# EAGLE board NeuroStimDuino_v2 (EAGLE 9.6.2), part 1 of 2
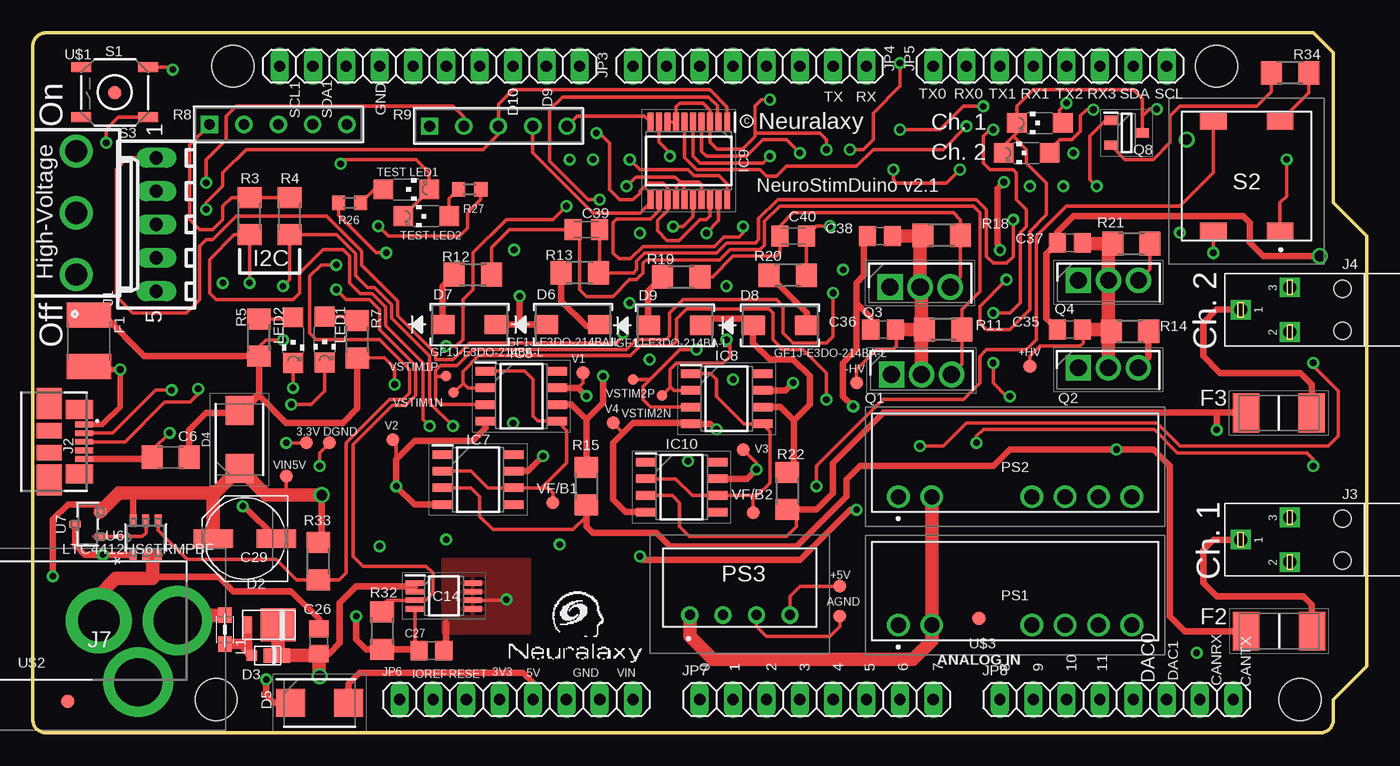
[diagram p6: board, top side]
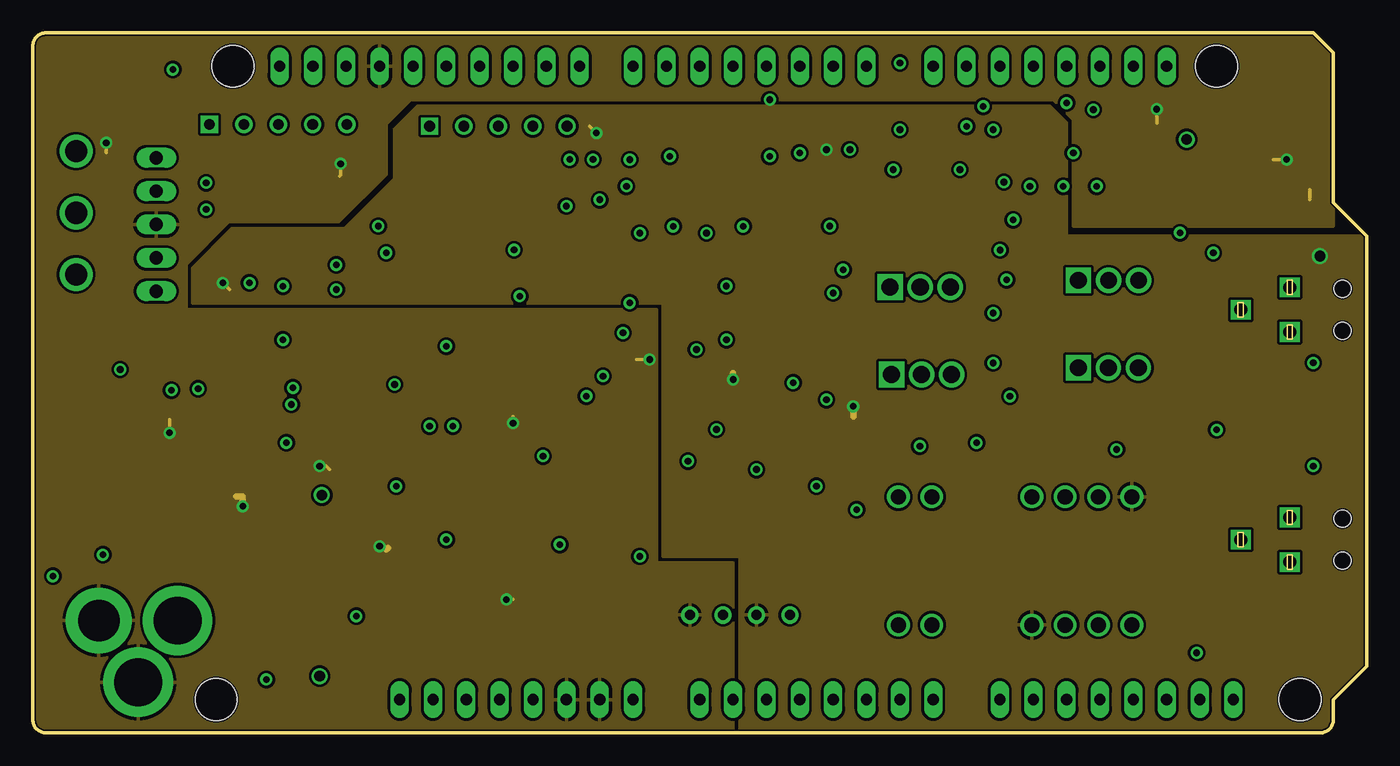
[diagram p7: board, inner layer Route2]
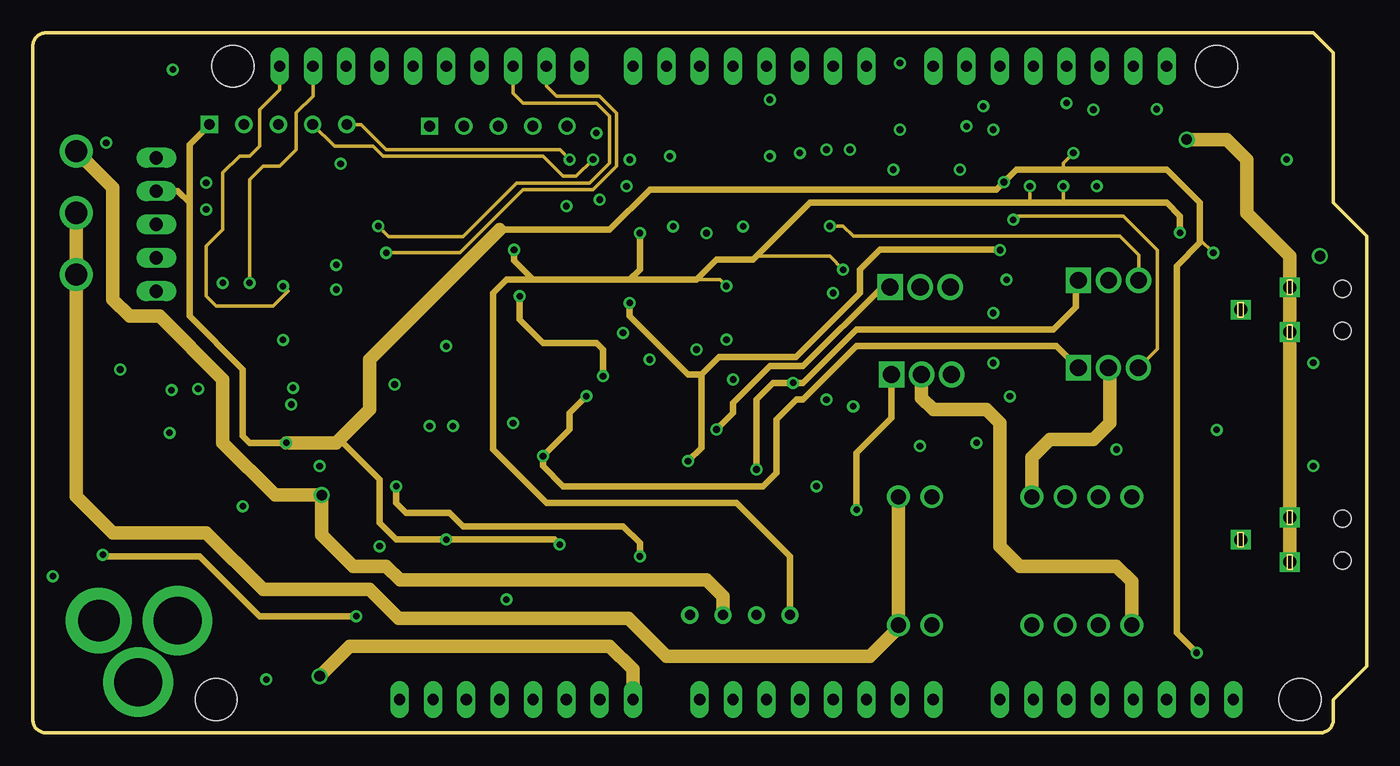
[diagram p8: board, inner layer Route15]
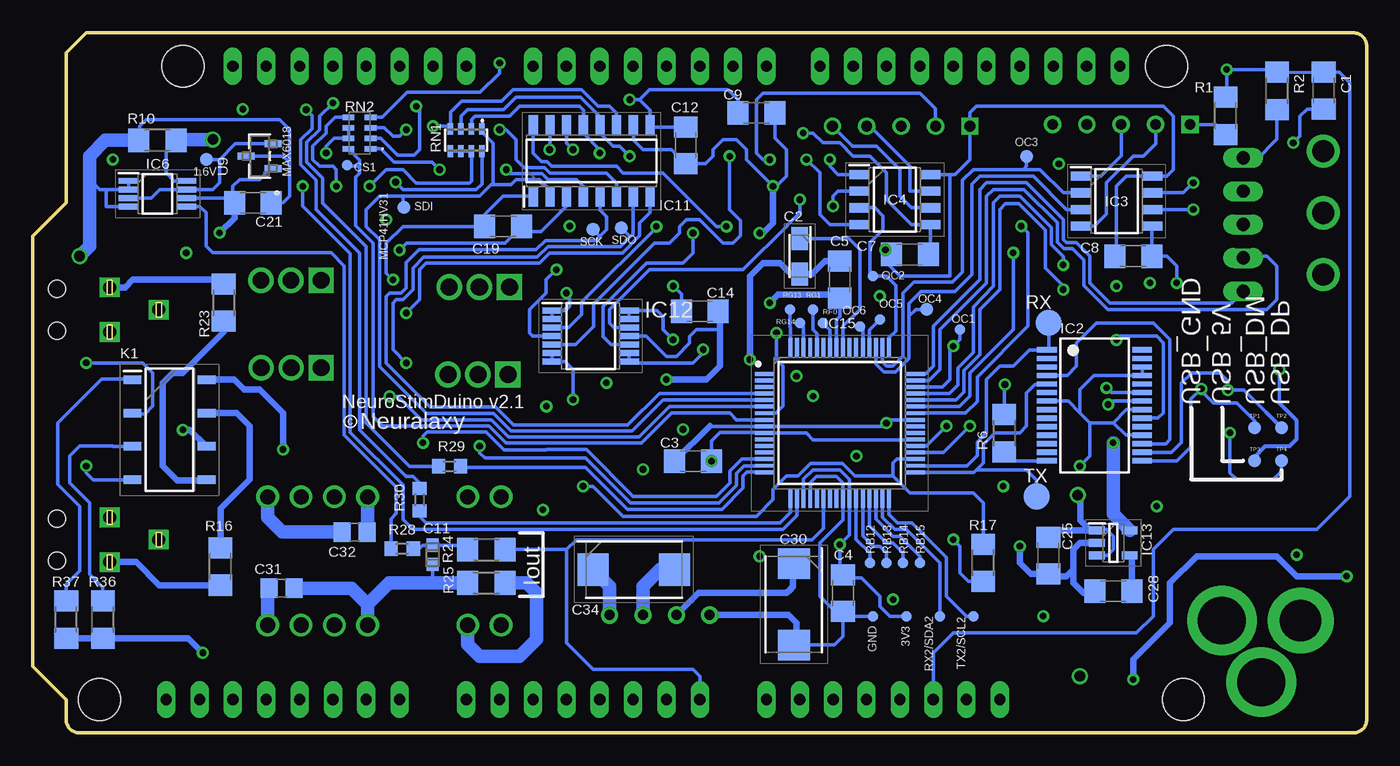
[diagram p9: board, bottom side, seen from below]

Size 101.6 x 53.34 mm. Coordinates in mm from the lower left corner, seen from the top.
Outline: 97.54,53.34 99.06,51.82 99.06,40.39 101.6,37.85 101.6,5.08 99.06,2.54 99.06,1 arc-90 98.06,0 1,0 arc-90 0,1 0,52.34 arc-90 1,53.34 97.54,53.34
Copper layers (1+2*15+16): Top 0.035mm / dielectric 0.2mm / Route2 0.035mm / dielectric 0.15mm / Route15 0.035mm / dielectric 0.2mm / Bottom 0.035mm
Design rules "default *": minimum track width 8mil, minimum drill 20mil, track to track 7mil, track to pad 7mil, pad to pad 7mil, via to via 7mil, smd to smd 5mil, copper to edge 5mil, drill to drill 5mil, minimum pad ring 10mil, minimum via ring 8mil, stop-mask expansion 4mil, vias tented up to drill 0mil, thermal gap 10mil
Net classes: 0 digital: width 0.203 mm, clearance 0.203 mm; 1 Power: width 0.254 mm, clearance 0.203 mm; 2 Signal: width 0.61 mm, clearance 0.305 mm; 3 usbvcc: width 0.203 mm, drill 0.406 mm, clearance 0.203 mm; 4 USBpair: width 0.254 mm, drill 0.406 mm, clearance 0.61 mm to class 0, clearance 0.61 mm to class 1, clearance 0.61 mm to class 2, clearance 0.61 mm to class 3
Holes 3.2 mm at 96.52,2.54 15.24,50.8 90.17,50.8 13.97,2.54
tRestrict: area 12.7,48.3 to 17.8,53.3; area 87.6,48.3 to 92.7,53.3; area 94,0 to 99.1,5.1; area 11.4,0 to 16.5,5.1
bRestrict: area 12.7,48.3 to 17.8,53.3; area 87.6,48.3 to 92.7,53.3; area 94,0 to 99.1,5.1; area 11.4,0 to 16.5,5.1

## Footprints (pad centres in the part's own frame; a part is rotated, then mirrored left to right if it is on the bottom)
TP10R = smd 1 x 1: TP 0,0
TP08R = smd 0.8 x 0.8: TP 0,0
C1206 = smd 1.6 x 1.8: 1 -1.4,0; 2 1.4,0
CAPPM3216X180N = smd 1.75 x 1.25: 1 -1.35,0; 2 1.35,0
CAPC17595_87N_KEM = smd 1.006 x 0.95: 1 -0.728,0; 2 0.728,0
C0805 = smd 1.3 x 1.5: 1 -0.95,0; 2 0.95,0
PANASONIC_D = smd 3 x 1.4: + 2.4,0; - -2.4,0
CAPPM7343X310N = smd 2.35 x 2.45: 1 -3.1,0; 2 3.1,0
C0805K = smd 1.3 x 1.6: 1 -1,0; 2 1,0
DO220AAL = smd 2.667 x 2.54: P$1 -0.7,0 | smd 0.762 x 1.27: P$2 1.65,0
MICROSMP = smd 0.8 x 0.8: A 1.2,0 | smd 2 x 1.1: K -0.7,0
DIOM5436X330N = smd 2.2 x 2.15: 1 -2.2,0; 2 2.2,0
DO-214BA-L = smd 1.803 x 1.473: 1 -2.045,0; 2 2.045,0
L1812 = smd 1.9 x 3.4: 1 -1.95,0; 2 1.95,0
FUSC6127X294N = smd 2.02 x 2.95: 1 -2.5,0; 2 2.5,0
SSOP28 = smd 0.4 x 1.5: 1 -4.225,-3.625; 2 -3.575,-3.625; 3 -2.925,-3.625; 4 -2.275,-3.625; 5 -1.625,-3.625; 6 -0.975,-3.625; 7 -0.325,-3.625; 8 0.325,-3.625; 9 0.975,-3.625; 10 1.625,-3.625; 11 2.275,-3.625; 12 2.925,-3.625; 13 3.575,-3.625; 14 4.225,-3.625; 15 4.225,3.625; 16 3.575,3.625; 17 2.925,3.625; 18 2.275,3.625; 19 1.625,3.625; 20 0.975,3.625; 21 0.325,3.625; 22 -0.325,3.625; 23 -0.975,3.625; 24 -1.625,3.625; 25 -2.275,3.625; 26 -2.925,3.625; 27 -3.575,3.625; 28 -4.225,3.625
SOIC127P594X363-8N = smd 1.52 x 0.7: 1 -2.715,1.905; 2 -2.715,0.635; 3 -2.715,-0.635; 4 -2.715,-1.905; 5 2.715,-1.905; 6 2.715,-0.635; 7 2.715,0.635; 8 2.715,1.905
SOIC127P600X175-8N = smd 1.525 x 0.65: 1 -2.712,1.905; 2 -2.712,0.635; 3 -2.712,-0.635; 4 -2.712,-1.905; 5 2.712,-1.905; 6 2.712,-0.635; 7 2.712,0.635; 8 2.712,1.905
SOP65P490X110-8N = smd 1.475 x 0.45: 1 -2.212,0.975; 2 -2.212,0.325; 3 -2.212,-0.325; 4 -2.212,-0.975; 5 2.212,-0.975; 6 2.212,-0.325; 7 2.212,0.325; 8 2.212,0.975
SOP65P640X120-20N = smd 1.475 x 0.45: 1 -2.938,2.925; 2 -2.938,2.275; 3 -2.938,1.625; 4 -2.938,0.975; 5 -2.938,0.325; 6 -2.938,-0.325; 7 -2.938,-0.975; 8 -2.938,-1.625; 9 -2.938,-2.275; 10 -2.938,-2.925; 11 2.938,-2.925; 12 2.938,-2.275; 13 2.938,-1.625; 14 2.938,-0.975; 15 2.938,-0.325; 16 2.938,0.325; 17 2.938,0.975; 18 2.938,1.625; 19 2.938,2.275; 20 2.938,2.925
SOIC127P599X152-16N = smd 1.513 x 0.7: 1 -2.719,4.445; 2 -2.719,3.175; 3 -2.719,1.905; 4 -2.719,0.635; 5 -2.719,-0.635; 6 -2.719,-1.905; 7 -2.719,-3.175; 8 -2.719,-4.445; 9 2.719,-4.445; 10 2.719,-3.175; 11 2.719,-1.905; 12 2.719,-0.635; 13 2.719,0.635; 14 2.719,1.905; 15 2.719,3.175; 16 2.719,4.445
SOP65P640X120-14N = smd 1.475 x 0.45: 1 -2.938,1.95; 2 -2.938,1.3; 3 -2.938,0.65; 4 -2.938,0; 5 -2.938,-0.65; 6 -2.938,-1.3; 7 -2.938,-1.95; 8 2.938,-1.95; 9 2.938,-1.3; 10 2.938,-0.65; 11 2.938,0; 12 2.938,0.65; 13 2.938,1.3; 14 2.938,1.95
SOT95P280X145-5N = smd 1.2 x 0.6: 1 -1.25,0.95; 2 -1.25,0; 3 -1.25,-0.95; 4 1.25,-0.95; 5 1.25,0.95
SOP65P490X109-8N = smd 1.415 x 0.45: 1 -2.192,0.975; 2 -2.192,0.325; 3 -2.192,-0.325; 4 -2.192,-0.975; 5 2.192,-0.975; 6 2.192,-0.325; 7 2.192,0.325; 8 2.192,0.975
QFP50P1200X1200X120-64N = smd 1.475 x 0.3: 1 -5.738,3.75; 2 -5.738,3.25; 3 -5.738,2.75; 4 -5.738,2.25; 5 -5.738,1.75; 6 -5.738,1.25; 7 -5.738,0.75; 8 -5.738,0.25; 9 -5.738,-0.25; 10 -5.738,-0.75; 11 -5.738,-1.25; 12 -5.738,-1.75; 13 -5.738,-2.25; 14 -5.738,-2.75; 15 -5.738,-3.25; 16 -5.738,-3.75; 33 5.738,-3.75; 34 5.738,-3.25; 35 5.738,-2.75; 36 5.738,-2.25; 37 5.738,-1.75; 38 5.738,-1.25; 39 5.738,-0.75; 40 5.738,-0.25; 41 5.738,0.25; 42 5.738,0.75; 43 5.738,1.25; 44 5.738,1.75; 45 5.738,2.25; 46 5.738,2.75; 47 5.738,3.25; 48 5.738,3.75 | smd 0.3 x 1.475: 17 -3.75,-5.738; 18 -3.25,-5.738; 19 -2.75,-5.738; 20 -2.25,-5.738; 21 -1.75,-5.738; 22 -1.25,-5.738; 23 -0.75,-5.738; 24 -0.25,-5.738; 25 0.25,-5.738; 26 0.75,-5.738; 27 1.25,-5.738; 28 1.75,-5.738; 29 2.25,-5.738; 30 2.75,-5.738; 31 3.25,-5.738; 32 3.75,-5.738; 49 3.75,5.738; 50 3.25,5.738; 51 2.75,5.738; 52 2.25,5.738; 53 1.75,5.738; 54 1.25,5.738; 55 0.75,5.738; 56 0.25,5.738; 57 -0.25,5.738; 58 -0.75,5.738; 59 -1.25,5.738; 60 -1.75,5.738; 61 -2.25,5.738; 62 -2.75,5.738; 63 -3.25,5.738; 64 -3.75,5.738
6410-05 = drill 1.016 long: 1 5.08,0; 2 2.54,0; 3 0,0; 4 -2.54,0; 5 -5.08,0
47346-0001 = smd 0.45 x 1.38: 1 1.3,-4.81; 2 0.65,-4.81; 3 0,-4.81; 4 -0.65,-4.81; 5 -1.3,-4.81 | smd 1.475 x 2.1: 6 -2.453,-4.45; 7 2.453,-4.45 | smd 1.175 x 1.9: 8 0.838,-2.15; 9 -0.838,-2.15 | smd 2.375 x 1.9: 10 2.913,-2.15; 11 -2.913,-2.15
081BB-2103300 = drill 1 square: P$1 0,-6.3; P$2 1.7,-2.55; P$3 -1.7,-2.55 | hole 1.3: 1.6,1.45; -1.6,1.45
CONSOCJ2155 = drill 3.64 pad 5.3: 1 0,0; 3 -3,-4.7 | drill 3.162 pad 5: 2 -6,0
1X10 = drill 0.85 pad 1.422 long: 1 -11.43,0; 2 -8.89,0; 3 -6.35,0; 4 -3.81,0; 5 -1.27,0; 6 1.27,0; 7 3.81,0; 8 6.35,0; 9 8.89,0; 10 11.43,0
1X08 = drill 0.85 pad 1.422 long: 1 -8.89,0; 2 -6.35,0; 3 -3.81,0; 4 -1.27,0; 5 1.27,0; 6 3.81,0; 7 6.35,0; 8 8.89,0
SOP254P610X218-8N = smd 1.35 x 0.65: 1 -2.825,3.81; 2 -2.825,1.27; 3 -2.825,-1.27; 4 -2.825,-3.81; 5 2.825,-3.81; 6 2.825,-1.27; 7 2.825,1.27; 8 2.825,3.81
0805 = smd 1.2 x 1: 1 -1.1,0; 2 1.1,0
CHIPLED_1206 = smd 1.5 x 1.5: A 0,-1.75; C 0,1.75
NMT1272SC = drill 1.15 pad 1.725: 1 -8.89,1.17; 2 -6.35,1.17; 5 1.27,1.17; 6 3.81,1.17; 7 6.35,1.17; 8 8.89,1.17
TEA10505 = drill 0.76 pad 1.303: 1 0,0; 2 2.54,0; 3 5.08,0; 4 7.62,0
TO229P300X760X1364-3P = drill 1.3 pad 1.95 square: 1 0,0 | drill 1.3 pad 1.95: 2 2.29,0; 3 4.58,0
TO229P290X760X1320-3P = drill 1.28 pad 1.92 square: 1 0,0 | drill 1.28 pad 1.92: 2 2.29,0; 3 4.58,0
SOT95P240X120-3N = smd 1 x 0.7: 1 -1.2,0.95; 2 -1.2,-0.95; 3 1.2,0
R1206 = smd 1.6 x 1.803: 1 -1.422,0; 2 1.422,0
BO_4605X = drill 0.813 pad 1.321 square: 1 0,0 | drill 0.813 pad 1.321: 2 2.616,0; 3 5.232,0; 4 7.849,0; 5 10.465,0
R0603 = smd 1 x 1.1: 1 -0.85,0; 2 0.85,0
CAY16-J4 = smd 0.425 x 0.9: 1 -1.2,-0.85; 2 -1.2,0.85; 3 -0.4,-0.85; 4 -0.4,0.85; 5 0.4,-0.85; 6 0.4,0.85; 7 1.2,-0.85; 8 1.2,0.85
CAY16181J4LF = smd 0.425 x 0.9: 1 -1.2,-0.85; 2 -0.4,-0.85; 3 0.4,-0.85; 4 1.2,-0.85; 5 1.2,0.85; 6 0.4,0.85; 7 -0.4,0.85; 8 -1.2,0.85
TP20R = smd 2 x 2: TP 0,0
TACTILE_SWITCH_SMD = smd 1.524 x 0.762: 1 -2.54,1.905; 2 2.54,1.905; 3 -2.54,-1.905; 4 2.54,-1.905
30062115 = smd 2.025 x 1.275: 1 2.538,-4.162; 2 -2.538,4.162; 3 -2.538,-4.162; 4 2.538,4.162
1000-SERIES(SPDT) = drill 1.68 pad 2.48: 1 0,-4.7; 2 0,0; 3 0,4.7
TP-1.00MM = smd 1 x 1 bottom: X 0,0
TSOT-23_S6_ADI = smd 0.876 x 0.508: 1 -1.314,0.95; 2 -1.314,0; 3 -1.314,-0.95; 4 1.314,-0.95; 5 1.314,0; 6 1.314,0.95
TO-236_SOT23_NEX-L = smd 0.483 x 0.864: 1 -0.95,-0.965; 2 0.95,-0.965; 3 0,0.965
21-0051H_MXM = smd 0.559 x 1.295: 1 -0.95,-1.029; 2 0.95,-1.029; 3 0,1.029
FIDUCIA-MOUNT = smd 1.016 x 1.016: P$1 0,0

## Placement (x,y rotation side)
1.6V  TPTP10R  [TP10R]  88.39,43.69 0 bottom
3.3V  TPTP10R  [TP10R]  20.83,22.1 0 top
3V3  TPTP08R  [TP08R]  35.06,8.87 0 bottom
+5V  TPTP10R  [TP10R]  61.47,11.18 0 top
+HV  TPTP10R  [TP10R]  75.95,27.94 0 top
-HV  TPTP10R  [TP10R]  62.74,26.67 0 top
AGND  TPTP10R  [TP10R]  61.47,8.89 0 top
C1  0.1uF  [C1206]  3.27,48.94 270 bottom
C2  F971C475MAAHT3  [CAPPM3216X180N]  43.18,36.32 270 bottom
C3  0.1uF  [C1206]  51.31,20.7 180 bottom
C4  0.1uF  [C1206]  39.89,10.65 270 bottom
C5  0.1uF  [C1206]  40.13,34.54 90 bottom
C6  10nF  [C1206]  10.49,20.99 180 top
C7  0.1uF  [C1206]  34.8,36.45 0 bottom
C8  0.1uF  [C1206]  17.78,36.32 0 bottom
C9  0.1uF  [C1206]  46.49,47.23 180 bottom
C11  56nF  [CAPC17595_87N_KEM]  71.15,13.57 270 bottom
C12  0.1uF  [C1206]  51.87,44.76 90 bottom
C14  0.1uF  [C1206]  50.8,32.13 0 bottom
C19  0.1uF  [C1206]  65.77,38.59 180 bottom
C21  100nF  [C1206]  84.84,40.39 0 bottom
C25  0.1uF  [C1206]  24.24,13.51 270 bottom
C26  1uF  [C0805]  21.8,6.99 90 top
C27  10uF  [C0805]  30.36,6.26 0 top
C28  10nF  [C1206]  19.3,10.81 180 bottom
C29  47uF  [PANASONIC_D]  16.15,14.81 180 top
C30  4.7uF  [CAPPM7343X310N]  43.63,9.79 270 bottom
C31  1uF  [C0805]  82.64,11.02 180 bottom
C32  1uF  [C0805]  77.1,15.3 180 bottom
C34  4.7uF  [CAPPM7343X310N]  55.82,12.44 0 bottom
C35  1uF  [C0805]  78.99,30.73 180 top
C36  1uF  [C0805]  64.77,30.73 180 top
C37  1uF  [C0805]  78.99,37.34 180 top
C38  1uF  [C0805]  64.52,37.85 180 top
C39  100nF  [C0805K]  42.16,38.35 180 top
C40  100nF  [C0805K]  57.91,37.85 180 top
CS1  TPTP08R  [TP08R]  77.65,43.26 0 bottom
D2  SS1P3L  [DO220AAL]  17.98,8.23 180 top
D3  MSS1P3L-M3/89A  [MICROSMP]  17.88,5.89 180 top
D4  LSM115JE3_TR13  [DIOM5436X330N]  15.75,22.35 90 top
D5  LSM115JE3_TR13  [DIOM5436X330N]  21.84,2.29 0 top
D6  GF1J-E3DO-214BA-L  [DO-214BA-L]  41.15,31.12 0 top
D7  GF1J-E3DO-214BA-L  [DO-214BA-L]  33.27,31.12 0 top
D8  GF1J-E3DO-214BA-L  [DO-214BA-L]  56.92,31.05 0 top
D9  GF1J-E3DO-214BA-L  [DO-214BA-L]  48.91,31.05 0 top
DGND  TPTP10R  [TP10R]  22.61,22.1 0 top
F1  MF-MSMF050-2 500mA  [L1812]  4.27,29.87 270 top
F2  0453.062MR  [FUSC6127X294N]  94.93,7.76 0 top
F3  0453.062MR  [FUSC6127X294N]  94.9,24.37 0 top
GND  TPTP08R  [TP08R]  37.6,8.87 0 bottom
IC2  FT232RL  [SSOP28]  20.73,24.96 270 bottom
IC3  HCPL0531  [SOIC127P594X363-8N]  19.05,40.51 0 bottom
IC4  HCPL0531  [SOIC127P594X363-8N]  35.94,40.64 0 bottom
IC5  INA149AID  [SOIC127P600X175-8N]  37.21,25.65 0 top
IC6  TSC2012IST  [SOP65P490X110-8N]  92.09,41.08 0 bottom
IC7  OPA140AID  [SOIC127P600X175-8N]  33.91,19.3 0 top
IC8  INA149AID  [SOIC127P600X175-8N]  52.85,25.46 0 top
IC9  MCP4341-103E_ST  [SOP65P640X120-20N]  49.97,43.6 270 top
IC10  OPA140AID  [SOIC127P600X175-8N]  49.42,18.73 0 top
IC11  ACSL-6410-00TE  [SOIC127P599X152-16N]  59.03,43.57 90 bottom
IC12  MCP6479-E_ST  [SOP65P640X120-14N]  59.11,30.24 0 bottom
IC13  TPS73633DBVR  [SOT95P280X145-5N]  19.3,14.48 0 bottom
IC14  MIC3975-5.0YMM-TR  [SOP65P490X109-8N]  31.31,10.44 0 top
IC15  DSPIC33FJ64GS606-I_PT  [QFP50P1200X1200X120-64N]  40.14,23.61 0 bottom
J1  22-27-2051-05  [6410-05]  9.4,38.73 90 top
J2  47346-0001  [47346-0001]  -0.9,22.18 90 top
J3  [081BB-2103300]  98.3,14.72 270 top
J4  [081BB-2103300]  98.3,32.24 270 top
J7  CON-SOCJ-2155  [CONSOCJ2155]  11.02,8.56 0 top
JP3  FH254-110DF08500V  [1X10]  30.23,50.8 180 top
JP4  FH254-108DF08500V  [1X08]  54.61,50.8 180 top
JP5  FH254-108DF08500V  [1X08]  77.47,50.8 0 top
JP6  FH254-108DF08500V  [1X08]  36.83,2.54 0 top
JP7  FH254-108DF08500V  [1X08]  59.69,2.54 0 top
JP8  FH254-108DF08500V  [1X08]  82.55,2.54 0 top
K1  CPC2125N  [SOP254P610X218-8N]  91.19,23.1 0 bottom
L1  MH2029-300Y  [0805]  14.63,7.87 90 top
LED1  [CHIPLED_1206]  22.22,29.97 180 top
LED2  [CHIPLED_1206]  19.83,29.93 180 top
LED5  [CHIPLED_1206]  28.45,41.4 270 top
LED6  [CHIPLED_1206]  29.97,39.37 90 top
LED7  [CHIPLED_1206]  76.71,46.47 90 top
LED8  [CHIPLED_1206]  75.7,44.18 90 top
OC1  TPTP08R  [TP08R]  30.99,30.73 90 bottom
OC2  TPTP08R  [TP08R]  37.59,34.8 0 bottom
OC3  TPTP10R  [TP10R]  25.91,43.94 0 bottom
OC4  TPTP10R  [TP10R]  33.53,32.26 0 bottom
OC5  TPTP08R  [TP08R]  37.09,31.48 0 bottom
OC6  TPTP08R  [TP08R]  38.61,30.97 0 bottom
PS1  NMT0572SC  [NMT1272SC]  74.82,7.04 0 top
PS2  NMT0572SC  [NMT1272SC]  74.82,16.82 0 top
PS3  TEA_1-0505  [TEA10505]  50.04,8.98 0 top
Q1  MJE350  [TO229P300X760X1364-3P]  65.41,27.31 0 top
Q2  MJE340  [TO229P290X760X1320-3P]  79.63,27.81 0 top
Q3  MJE350  [TO229P300X760X1364-3P]  65.3,33.97 0 top
Q4  MJE340  [TO229P290X760X1320-3P]  79.65,34.48 0 top
Q8  MMBT3906  [SOT95P240X120-3N]  83.31,45.72 0 top
R1  10K  [R1206]  10.75,47.02 270 bottom
R2  470E  [R1206]  6.84,48.91 270 bottom
R3  10K  [R1206]  16.51,39.37 270 top
R4  10K  [R1206]  19.56,39.37 270 top
R5  330E  [R1206]  17.23,30.12 270 top
R6  10K  [R1206]  27.6,22.84 90 bottom
R7  330E  [R1206]  24.72,29.99 270 top
R8  4605X-101-221LF  [BO_4605X]  13.46,46.36 0 top
R9  4605X-101-332LF  [BO_4605X]  30.23,46.23 0 top
R10  0.5E  [R1206]  92.09,45.14 0 bottom
R11  35.7K  [R1206]  69.34,30.73 0 top
R12  10K, 1/2W  [R1206]  33.53,34.93 180 top
R13  10K, 1/2W  [R1206]  41.66,35.05 0 top
R14  35.7K  [R1206]  83.57,30.61 180 top
R15  100E, 1/2W  [R1206]  42.16,18.8 90 top
R16  10E, 3/4W  [R1206]  87.31,12.68 270 bottom
R17  3.3K  [R1206]  29.21,12.95 270 bottom
R18  35.7K  [R1206]  69.23,37.91 0 top
R19  10K, 1/2W  [R1206]  49.38,34.74 180 top
R20  10K, 1/2W  [R1206]  57.51,34.87 0 top
R21  35.7K  [R1206]  83.67,37.28 180 top
R22  100E, 1/2W  [R1206]  57.47,18.44 90 top
R23  10E, 3/4W  [R1206]  87.06,32.79 90 bottom
R24  0E  [R1206]  67.06,13.97 180 bottom
R25  0E  [R1206]  67.06,11.43 180 bottom
R26  330E  [R0603]  24.13,40.39 180 top
R27  330E  [R0603]  33.27,41.4 0 top
R28  330E  [R0603]  73.46,14.03 0 bottom
R29  330E  [R0603]  69.85,20.3 0 bottom
R30  330E  [R0603]  72.14,17.76 270 bottom
R32  100K  [R1206]  26.61,7.79 90 top
R33  470K  [R1206]  21.74,13.08 270 top
R34  220E  [R1206]  95.76,50.29 0 top
R36  330E  [R1206]  96.27,8.64 270 bottom
R37  330E  [R1206]  99.06,8.64 270 bottom
RB12  TPTP08R  [TP08R]  37.85,12.94 270 bottom
RB13  TPTP08R  [TP08R]  36.58,12.94 90 bottom
RB14  TPTP08R  [TP08R]  35.31,12.94 270 bottom
RB15  TPTP08R  [TP08R]  34.04,12.94 270 bottom
RF0  TPTP08R  [TP08R]  41.41,31.23 0 bottom
RG1  TPTP08R  [TP08R]  42.17,32.24 0 bottom
RG13  TPTP08R  [TP08R]  43.95,32.24 0 bottom
RG14  TPTP08R  [TP08R]  43.18,31.23 0 bottom
RN1  CAY16-332J4LF  [CAY16-J4]  68.58,45.17 180 bottom
RN2  CAY16-181J4LF  [CAY16181J4LF]  76.71,45.7 90 bottom
RX  TPTP20R  [TP20R]  24.22,31.23 0 bottom
RX2/SDA2  TPTP08R  [TP08R]  32.52,8.87 0 bottom
S1  SWITCH-MOMENTARY-2SMD  [TACTILE_SWITCH_SMD]  6.24,48.8 180 top
S2  3006.2115  [30062115]  92.46,42.42 0 top
S3  1101M2S3CQE2  [1000-SERIES(SPDT)]  3.3,39.62 0 top
SCK  TPTP10R  [TP10R]  58.93,38.35 0 bottom
SDI  TPTP10R  [TP10R]  73.33,40.03 0 bottom
SDO  TPTP10R  [TP10R]  56.77,38.48 0 bottom
TP1  DNP  [TP-1.00MM]  8.53,23.27 0 top
TP2  DNP  [TP-1.00MM]  6.5,23.27 0 top
TP3  DNP  [TP-1.00MM]  8.53,20.73 0 top
TP4  DNP  [TP-1.00MM]  6.5,20.73 0 top
TX  TPTP20R  [TP20R]  25.15,18.02 0 bottom
TX2/SCL2  TPTP08R  [TP08R]  29.97,8.89 0 bottom
U6  LTC4412HS6TRMPBF  [TSOT-23_S6_ADI]  8.6,14.89 90 top
U7  PMV48XP,215TO-236_SOT23_NEX-L  [TO-236_SOT23_NEX-L]  4.18,15.9 90 top
U9  MAX6018BEUR16+T  [21-0051H_MXM]  84.33,43.94 90 bottom
U$1  FIDUCIALMOUNT  [FIDUCIA-MOUNT]  6.22,48.77 0 top
U$2  FIDUCIALMOUNT  [FIDUCIA-MOUNT]  2.67,2.41 0 top
U$3  FIDUCIALMOUNT  [FIDUCIA-MOUNT]  72.06,8.71 0 top
V1  TPTP10R  [TP10R]  41.91,27.43 0 top
V2  TPTP10R  [TP10R]  27.43,22.35 0 top
V3  TPTP10R  [TP10R]  54.1,21.59 0 top
V4  TPTP10R  [TP10R]  44.2,23.62 0 top
VF/B1  TPTP10R  [TP10R]  39.62,17.53 180 top
VF/B2  TPTP10R  [TP10R]  54.86,16.76 0 top
VIN5V  TPTP10R  [TP10R]  19.3,19.56 0 top
VSTIM1N  TPTP08R  [TP08R]  32.06,25.92 0 top
VSTIM1P  TPTP08R  [TP08R]  31.5,27.18 0 top
VSTIM2N  TPTP08R  [TP08R]  47.93,25.71 0 top
VSTIM2P  TPTP08R  [TP08R]  45.72,26.92 180 top